# Altium schematic sheet RF.SchDoc: RF part
size A4; Author: PhA; SheetNumber: 4; SheetTotal: 8
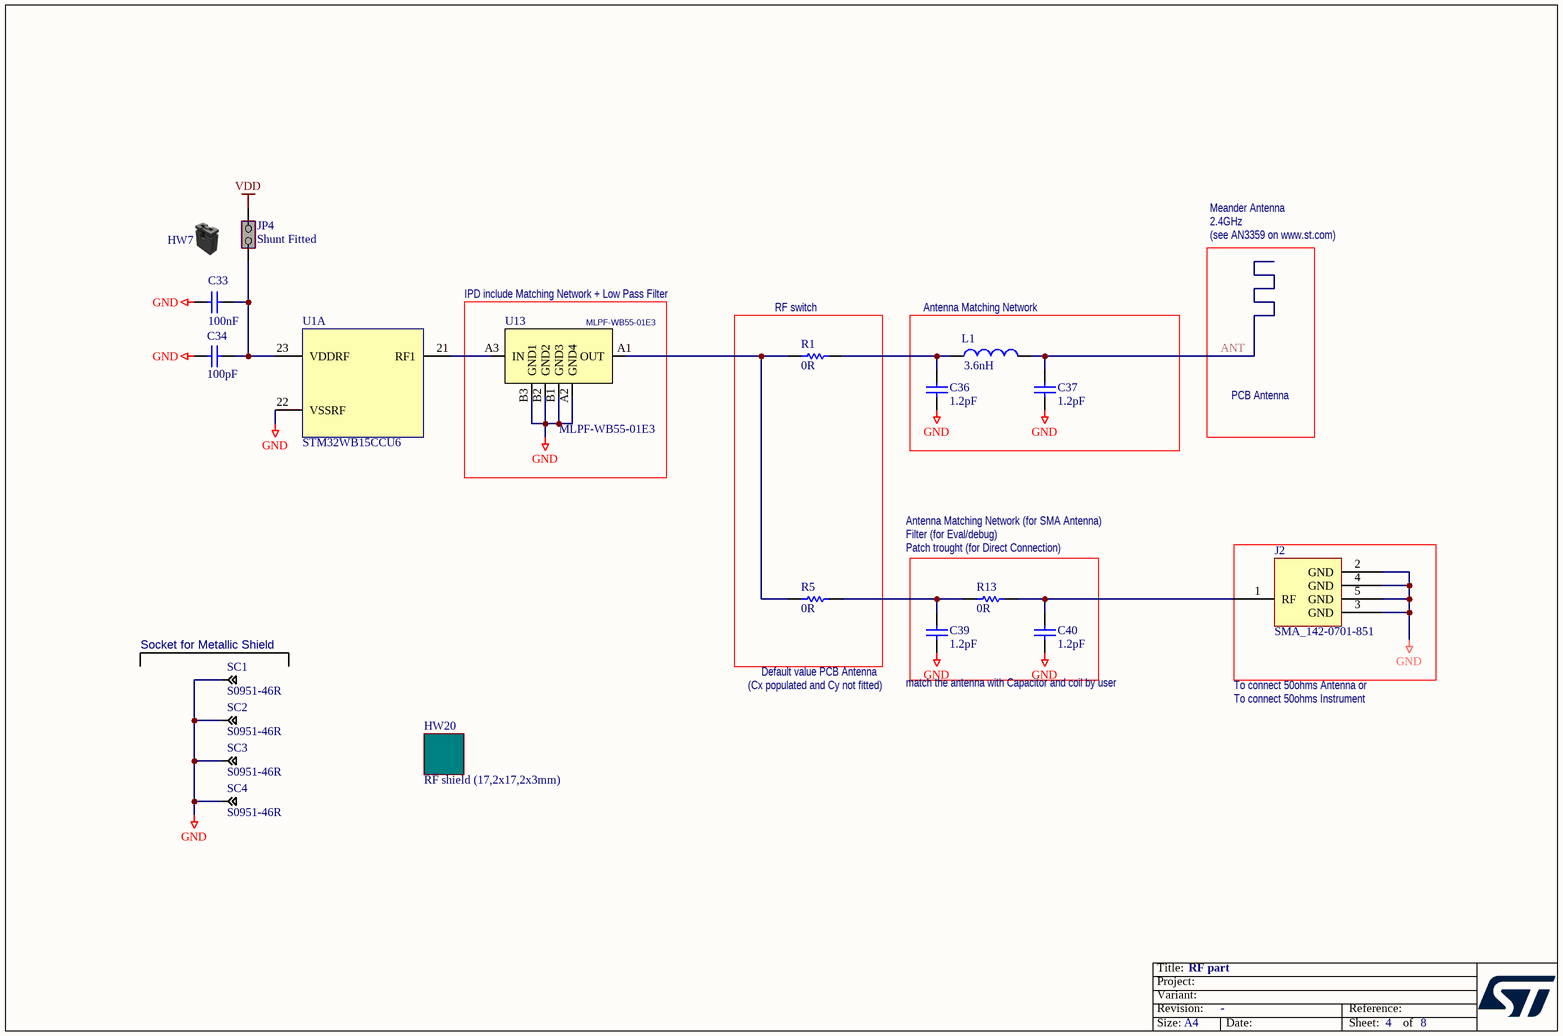
[diagram p0: RF.SchDoc]

## Parts
C33  value 100nF  [C0402]  (hidden comment: Capacitor)
C34  value 100pF  [C0402]  (hidden comment: Capacitor)
C36  value 1.2pF  [C0402]  (hidden comment: Capacitor)
C37  value 1.2pF  [C0402]  (hidden comment: Capacitor)
C39  value 1.2pF  [C0402]  (hidden comment: Capacitor)
C40  value 1.2pF  [C0402]  (hidden comment: Capacitor)
HW7  Shunt Black 2.54mm  (value not drawn)  (mechanical)
HW20  value RF shield (17,2x17,2x3mm)  [SHIELD_RF_ST-CUSTOM_17P2X17P2_H3]  (hidden comment: Daughter_Board)
J2  value SMA_142-0701-851  [CON_SMA-RF_CINCH_142-0701-851]  (hidden comment: SMA-J-P-H-ST-EM1)
JP4  value Shunt Fitted  [CON_SAMTEC_TSW-102-07-G-S]  (hidden comment: Jumper_Header 2x1 Fitted)
L1  value 3.6nH  [IND_0402_MURATA_LGQ15HS02_H0P5]  (hidden comment: Inductor)
R1  value 0R  [R0402]  (hidden comment: Resistor)
R5  value 0R  [R0402]  (hidden comment: Resistor)
R13  value 0R  [R0402]  (hidden comment: Resistor)
SC1  value S0951-46R  [CLIP_HARWIN_S0951-46R]  (hidden comment: Shield-clip_S0951-46R)
SC2  value S0951-46R  [CLIP_HARWIN_S0951-46R]  (hidden comment: Shield-clip_S0951-46R)
SC3  value S0951-46R  [CLIP_HARWIN_S0951-46R]  (hidden comment: Shield-clip_S0951-46R)
SC4  value S0951-46R  [CLIP_HARWIN_S0951-46R]  (hidden comment: Shield-clip_S0951-46R)
U1  value STM32WB15CCU6  [ICC_UFQFPN48-EPAD_7X7_H0P55_P050]  (hidden comment: STM32WB15_QFN48)  (part A of 5)
U13  MLPF-WB55-01E3  [ICC_BUMPLESS-CSP6_AN2348-FLIP-CHIP_1X1P60_P050-P0587]

## Blocks framed on the sheet
IPD include Matching Network + Low Pass Filter: U13
RF switch: R1 R5
Antenna Matching Network: C36 C37 L1

## Nets
GND: C33.1 C34.1 C36.1 C37.1 C39.1 C40.1 J2.2(GND) J2.3(GND) J2.4(GND) J2.5(GND) SC1.1 SC2.1 SC3.1 SC4.1 U1.22(VSSRF) U13.A2(GND4) U13.B1(GND3) U13.B2(GND2) U13.B3(GND1)
VDD: JP4.1(COMMON)
ANT: C37.2 L1.2
NetC33_2: C33.2 C34.2 JP4.2(NO) U1.23(VDDRF)
NetC36_2: C36.2 L1.1 R1.2
NetC39_2: C39.2 R5.2 R13.1
NetC40_2: C40.2 J2.1(RF) R13.2
NetR1_1: R1.1 R5.1 U13.A1(OUT)
NetU1_21: U1.21(RF1) U13.A3(IN)

## Notes on the sheet
- Meander Antenna
- 2.4GHz
- (see AN3359 on www.st.com)
- PCB Antenna
- Antenna Matching Network (for SMA Antenna)
- Filter (for Eval/debug)
- (near R13) Patch trought (for Direct Connection)
- (near SC1) Socket for Metallic Shield
- (near C39) (Cx populated and Cy not fitted)
- (near C39) Default value PCB Antenna
- match the antenna with Capacitor and coil by user
- To connect 50ohms Antenna or
- To connect 50ohms Instrument
- Title:
- Project:
- Size:
- Revision:
- Variant:
- A4
- -
- Date:
- Reference:
- Sheet:
- of

## Library data of the parts
C33 = MCD-00006: Capacitor, MLCC, 100nF, 16V, X7R, +/-10%, 0402, T=0.5mm; Manufacturer_Part_Number: CC0402KRX7R7BB104; Manufacturer: YAGEO; Alternate_Manufacturer_Part_Number: GCM155R71C104KA55D; Alternate_Manufacturer: MURATA; Part_Preference: Recommended; Order_Code_RS: 616-9701; Internal_Part_Number: MCD-00006; Status: Released; Part_Type: Capacitor; Package: C0402; ComponentLink1URL: http://tunmcdsvn.tun.st.com/Component_Datasheet_Library/Trunk/Capacitors/Yageo_Multilayer_Capacitor_X7R_series_100pF_to_22uF; Order_Code_Digikey: 311-1338-1-ND; Order_Code_Farnell: 9402047
C34 = MCD-00205: Capacitor,MLCC,100pF,50V,NPO,+/-5%,0402,T=0,5mm; Manufacturer_Part_Number: CC0402JRNPO9BN101; Manufacturer: YAGEO; Part_Preference: Recommended; Internal_Part_Number: MCD-00205; Status: Released; Part_Type: Capacitor; Package: C0402; ComponentLink1URL: http://tunmcdsvn.tun.st.com/Component_Datasheet_Library/Trunk/Capacitors/Yageo_Capacitor_NP0_16V-to-50V; Order_Code_Digikey: 311-1024-1-ND; Order_Code_Farnell: 3019226RL; Order_Code_RS: N/A
C36 C37 C39 C40 = MCD-02065: Capacitor, High Q type for high frequency and high power, SMD, 1.2pF, 50V, 0,05pf, 0402; Manufacturer_Part_Number: GJM1555C1H1R2WB01D; Manufacturer: MURATA; Part_Preference: Recommended; Order_Code_RS: 846-7246; Internal_Part_Number: MCD-02065; Status: Checked; Part_Type: Capacitor; Package: C0402; ComponentLink1URL: http://tunmcdsvn.tun.st.com/Component_Datasheet_Library/Trunk/Capacitors/MURATA_Chip_Monolithic_Ceramic_Capacitors; Alternate_Manufacturer_Part_Number: N/A; Alternate_Manufacturer: N/A; Order_Code_Digikey: 490-11195-2-ND; Order_Code_Farnell: 2781428
HW7 = MCD-00043: SHUNT 2.54mm BLACK; Manufacturer_Part_Number: SNT-100-BK-G; Manufacturer: SAMTEC; Part_Type: Misc; Part_Preference: Recommended; Alternate_Manufacturer: JIUBABA; Alternate_Manufacturer_Part_Number: 316102S111A; Value: SNT-100-BK-G; Internal_Part_Number: MCD-00043; Status: Released; ComponentLink1URL: http://tunmcdsvn.tun.st.com/Component_Datasheet_Library/Trunk/Connectors/Samtec_Shunt_Jumper_SNT100
HW20 = MCD-02088: RF shield (17,2x17,2x3mm), Brass with Sn finishing, Sheet tickness : 0,2mm; Part_Type: Misc; Part_Preference: Recommended; Internal_Part_Number: MCD-02088; Status: Checked; Manufacturer_Part_Number: RF shield (17,2x17,2x3mm); Manufacturer: N/A; Alternate_Manufacturer_Part_Number: N/A; Alternate_Manufacturer: N/A; Package: N/A; ComponentLink1URL: http://tunmcdsvn.tun.st.com/Component_Datasheet_Library/Trunk/Misc/RF shielded box (17,2x17,2x3mm); Order_Code_Digikey: N/A; Order_Code_Farnell: N/A; Order_Code_RS: N/A
J2 = MCD-02072: RF SMA connector PCB edge; Manufacturer_Part_Number: 142-0701-851; Manufacturer: JOHNSON; Part_Preference: Recommended; Order_Code_RS: 885-7532; Internal_Part_Number: MCD-02072; Status: Checked; Part_Type: Connector; ComponentLink1URL: http://tunmcdsvn.tun.st.com/Component_Datasheet_Library/Trunk/Connectors/JOHNSON_SMA_142-0701-851; Order_Code_Farnell: 1019325; Alternate_Manufacturer: N/A; Alternate_Manufacturer_Part_Number: N/A; Order_Code_Digikey: J658-ND
JP4 = MCD-00683: Header, 2x1, 2,54mm, VR, TH, Height 5.84mm/2.54mm - Shunt Fitted by default; Part_Type: Connector; Manufacturer_Part_Number: TSW-102-07-G-S; Manufacturer: SAMTEC; Alternate_Manufacturer_Part_Number: 313102S111116; Alternate_Manufacturer: LIANYI; Part_Preference: Recommended; Internal_Part_Number: MCD-00683; Status: Released; ComponentLink1URL: http://tunmcdsvn.tun.st.com/Component_Datasheet_Library/Trunk/Connectors/Samtec_TSW-HTSW-series
L1 = MCD-01461: Inductor, LQG15H, 3.6nH, +-0.3nH 0402; Manufacturer_Part_Number: LQG15HS3N6S02; Manufacturer: MURATA; Part_Preference: Recommended; Internal_Part_Number: MCD-01461; Status: Checked; Part_Type: Inductor; Package: 0402; ComponentLink1URL: http://tunmcdsvn.tun.st.com/Component_Datasheet_Library/Trunk/Inductors/Murata_inductor_LQG15HS3N6S02/LQG15HS3N6S02.pdf
R1 R5 R13 = MCD-00052: Resistor,0R,0402,5%,1/16W; Part_Preference: Recommended; Manufacturer: YAGEO; Manufacturer_Part_Number: RC0402JR-070RL; Order_Code_RS: 618-5804; Internal_Part_Number: MCD-00052; Status: Released; Part_Type: Resistor; Package: R0402; ComponentLink1URL: http://tunmcdsvn.tun.st.com/Component_Datasheet_Library/Trunk/Resistors/Yageo_Resistor_RC0402-series; Order_Code_Digikey: 311-0.0JRCT-ND; Order_Code_Farnell: 9232516RL
SC1-SC4 = MCD-01587: shield clip Harwin S0951-46R to fix RF shielded cavity; Part_Type: Misc; Part_Preference: Recommended; Internal_Part_Number: MCD-01587; Status: Released; Manufacturer_Part_Number: S0951-46R; Manufacturer: HARWIN; ComponentLink1URL: http://tunmcdsvn.tun.st.com/Component_Datasheet_Library/Trunk/Connectors/Harwin_Shield-clip_S0951-46R; Alternate_Manufacturer: N/A; Alternate_Manufacturer_Part_Number: N/A; Order_Code_Digikey: 952-2669-1-ND; Order_Code_Farnell: 2490970; Order_Code_RS: N/A
U1 = MCD-02058: Multiprotocol wireless 32-bit MCU ARM®-based Cortex®-M4 with FPU, Bluetooth® Low-Energy and 802.15.4 radio solution; Part_Type: IC; Manufacturer: STMICROELECTRONICS; Part_Preference: Recommended; Manufacturer_HQ_COO: EU; Component_Country_Of_Origin: China; Internal_Part_Number: MCD-02058; Status: Standby; Manufacturer_Part_Number: STM32WB15CCU6; Package: UFQFPN48; ComponentLink1URL: http://tunmcdsvn.tun.st.com/Component_Datasheet_Library/Trunk/IC/STM_MCU_STM32WB15CCU6; Alternate_Manufacturer: N/A; Alternate_Manufacturer_Part_Number: N/A; Order_Code_Digikey: N/A; Order_Code_Farnell: N/A; Order_Code_RS: N/A
U13 = MCD-02059: 2.4 GHz low pass filter matched to STM32WBx5Cx/Rx; Part_Type: IC; Manufacturer: STMICROELECTRONICS; Part_Preference: Recommended; Manufacturer_HQ_COO: EU; Component_Country_Of_Origin: China; Internal_Part_Number: MCD-02059; Value: MLPF-WB55-01E3; Status: Checked; Manufacturer_Part_Number: MLPF-WB55-01E3; Package: Bumpless CSP; ComponentLink1URL: http://tunmcdsvn.tun.st.com/Component_Datasheet_Library/Trunk/IC/STM_Filter_MLPF-WB55-01E3/STM_Filter_MLPF-WB55-01E3.pdf; Alternate_Manufacturer: N/A; Alternate_Manufacturer_Part_Number: N/A; Order_Code_Digikey: 497-19088-2-ND; Order_Code_Farnell: 3106011; Order_Code_RS: N/A